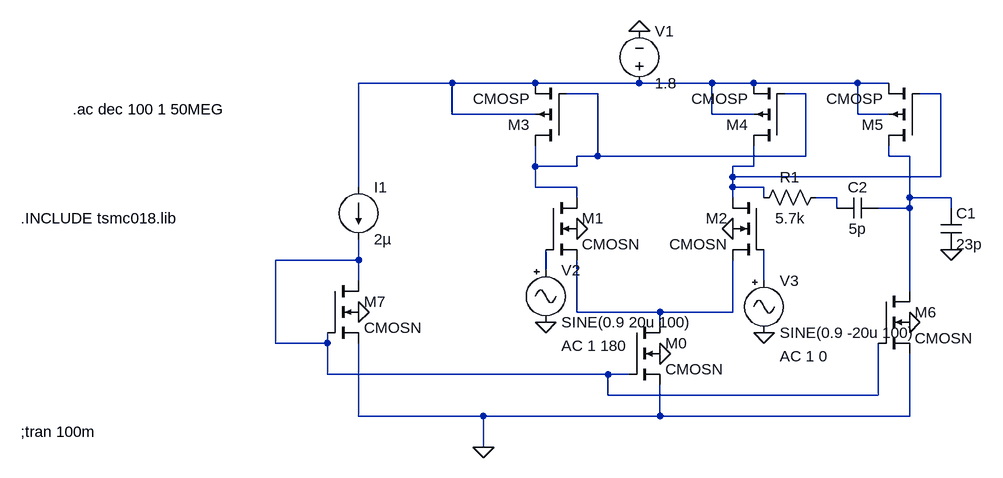
[diagram p0: schematic final ota after tuning.asc]
final ota after tuning.asc, the LTspice schematic file:
Version 4
SHEET 1 880 680
WIRE -64 16 -208 16
WIRE 64 16 -64 16
WIRE 224 16 64 16
WIRE 336 16 224 16
WIRE 400 16 336 16
WIRE 560 16 400 16
WIRE 608 16 560 16
WIRE 160 32 112 32
WIRE 480 32 448 32
WIRE 688 32 656 32
WIRE -64 64 -64 16
WIRE 64 64 -64 64
WIRE 336 64 336 16
WIRE 400 64 336 64
WIRE 560 64 560 16
WIRE 608 64 560 64
WIRE 160 128 160 32
WIRE 160 128 128 128
WIRE 480 128 480 32
WIRE 480 128 160 128
WIRE 608 128 608 112
WIRE 640 128 608 128
WIRE 64 144 64 112
WIRE 128 144 128 128
WIRE 128 144 64 144
WIRE 400 144 400 112
WIRE 400 144 368 144
WIRE 368 160 368 144
WIRE 688 160 688 32
WIRE 688 160 368 160
WIRE -208 176 -208 16
WIRE 64 176 64 144
WIRE 128 176 64 176
WIRE 368 176 368 160
WIRE 416 176 368 176
WIRE 128 192 128 176
WIRE 368 192 368 176
WIRE 416 192 416 176
WIRE 528 192 496 192
WIRE 640 192 640 128
WIRE 704 192 640 192
WIRE 528 208 528 192
WIRE 640 208 640 192
WIRE 640 208 592 208
WIRE 704 208 704 192
WIRE -208 288 -208 256
WIRE -208 288 -336 288
WIRE 80 304 80 272
WIRE -208 320 -208 288
WIRE 416 320 416 272
WIRE 640 336 640 208
WIRE 128 368 128 288
WIRE 256 368 128 368
WIRE 368 368 368 288
WIRE 368 368 256 368
WIRE 256 384 256 368
WIRE -336 416 -336 288
WIRE -256 416 -256 400
WIRE -256 416 -336 416
WIRE -256 464 -256 416
WIRE 176 464 -256 464
WIRE 208 464 176 464
WIRE 176 496 176 464
WIRE 592 496 592 416
WIRE 592 496 176 496
WIRE -208 528 -208 416
WIRE -16 528 -208 528
WIRE 256 528 256 480
WIRE 256 528 -16 528
WIRE 640 528 640 432
WIRE 640 528 256 528
WIRE -16 576 -16 528
FLAG 224 -64 0
FLAG -208 368 0
FLAG 256 432 0
FLAG 640 384 0
FLAG 368 240 0
FLAG 128 240 0
FLAG 416 400 0
FLAG -16 576 0
FLAG 80 384 0
FLAG 704 272 0
SYMBOL cmosn 80 192 R0
SYMATTR InstName M1
SYMATTR Value2 l=0.9u w=86.994u
SYMBOL cmosn 416 192 M0
SYMATTR InstName M2
SYMATTR Value2 l=0.9u w=86.994u
SYMBOL cmosn 592 336 R0
SYMATTR InstName M6
SYMATTR Value2 l=0.18u w=2.34u
SYMBOL cmosp 448 112 R180
SYMATTR InstName M4
SYMATTR Value2 l=0.9u w=14.877u
SYMBOL cmosp 656 112 R180
SYMATTR InstName M5
SYMATTR Value2 l=0.18u w=17.85u
SYMBOL cmosn -256 320 R0
SYMATTR InstName M7
SYMATTR Value2 l=0.9u w=0.3915u
SYMBOL cmosn 208 384 R0
SYMATTR InstName M0
SYMATTR Value2 l=0.9u w=3.915u
SYMBOL current -208 176 R0
WINDOW 123 0 0 Left 2
WINDOW 39 0 0 Left 2
SYMATTR InstName I1
SYMATTR Value 2µ
SYMBOL voltage 224 32 M180
WINDOW 0 24 96 Left 2
WINDOW 3 24 16 Left 2
WINDOW 123 0 0 Left 2
WINDOW 39 0 0 Left 2
SYMATTR InstName V1
SYMATTR Value 1.8
SYMBOL Misc\\signal 416 304 R0
WINDOW 123 24 132 Left 2
WINDOW 39 0 0 Left 2
SYMATTR Value2 AC 1 0
SYMATTR InstName V3
SYMATTR Value SINE(0.9 -20u 100)
SYMBOL cmosp 112 112 R180
SYMATTR InstName M3
SYMATTR Value2 l=0.9u w=14.877u
SYMBOL cap 592 192 R90
WINDOW 0 0 32 VBottom 2
WINDOW 3 32 32 VTop 2
SYMATTR InstName C2
SYMATTR Value 5p
SYMBOL res 512 176 R90
WINDOW 0 0 56 VBottom 2
WINDOW 3 32 56 VTop 2
SYMATTR InstName R1
SYMATTR Value 5.7k
SYMBOL Misc\\signal 80 288 R0
WINDOW 123 24 132 Left 2
WINDOW 39 0 0 Left 2
SYMATTR Value2 AC 1 180
SYMATTR InstName V2
SYMATTR Value SINE(0.9 20u 100)
SYMBOL cap 688 208 R0
SYMATTR InstName C1
SYMATTR Value 23p
TEXT -728 224 Left 2 !.INCLUDE tsmc018.lib
TEXT -728 552 Left 2 !;tran 100m
TEXT -648 56 Left 2 !.ac dec 100 1 50MEG

The netlist it stands for:
* final ota after tuning.asc
M1 N002 N007 N009 0 CMOSN l=0.9u w=86.994u
M2 N003 N008 N009 0 CMOSN l=0.9u w=86.994u
M6 N004 N006 0 0 CMOSN l=0.18u w=2.34u
M4 N003 N002 N001 N001 CMOSP l=0.9u w=14.877u
M5 N004 N003 N001 N001 CMOSP l=0.18u w=17.85u
M7 N006 N006 0 0 CMOSN l=0.9u w=0.3915u
M0 N009 N006 0 0 CMOSN l=0.9u w=3.915u
I1 N001 N006 2µ
V1 N001 0 1.8
V3 N008 0 SINE(0.9 -20u 100) AC 1 0
M3 N002 N002 N001 N001 CMOSP l=0.9u w=14.877u
C2 N004 N005 5p
R1 N005 N003 5.7k
V2 N007 0 SINE(0.9 20u 100) AC 1 180
C1 N004 0 23p
.model NMOS NMOS
.model PMOS PMOS
.lib standard.mos
.INCLUDE tsmc018.lib
;tran 100m
.ac dec 100 1 50MEG
.backanno
.end